# Altium schematic sheet ON_OFF_POWER_LED_v2_schematic.SchDoc
size A
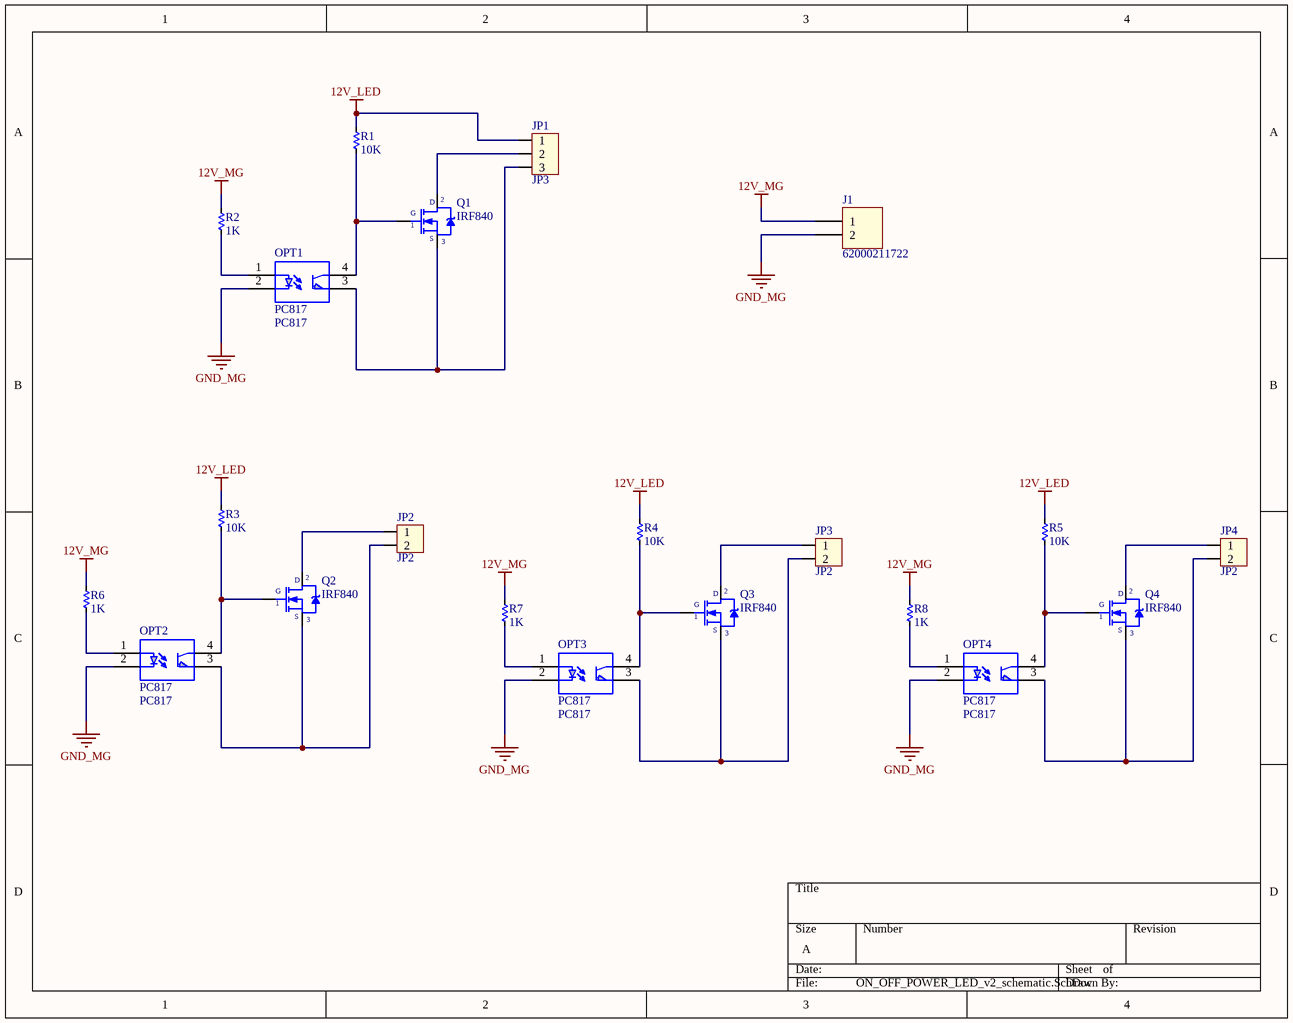
[diagram p0: ON_OFF_POWER_LED_v2_schematic.SchDoc]

## Parts
J1  62000211722  [62000211722]
JP1  JP3  [CON 3/7.62mm]
JP2  JP2  [CON 2/7.62mm]
JP3  JP2  [CON 2/7.62mm]
JP4  JP2  [CON 2/7.62mm]
OPT1  PC817  [DIP-4 SMD]
OPT2  PC817  [DIP-4 SMD]
OPT3  PC817  [DIP-4 SMD]
OPT4  PC817  [DIP-4 SMD]
Q1  IRF840  [TO220H1]
Q2  IRF840  [TO220H1]
Q3  IRF840  [TO220H1]
Q4  IRF840  [TO220H1]
R1  10K  [RES-SMD-0805]
R2  1K  [RES-SMD-0805]
R3  10K  [RES-SMD-0805]
R4  10K  [RES-SMD-0805]
R5  10K  [RES-SMD-0805]
R6  1K  [RES-SMD-0805]
R7  1K  [RES-SMD-0805]
R8  1K  [RES-SMD-0805]

## Nets
12V_LED: JP1.1 R1.1 R3.1 R4.1 R5.1
12V_MG: J1.1 R2.1 R6.1 R7.1 R8.1
GND_MG: J1.2 OPT1.2(K) OPT2.2(K) OPT3.2(K) OPT4.2(K)
NetJP1_2: JP1.2 Q1.2(D)
NetJP1_3: JP1.3 OPT1.3(EMISSOR) Q1.3(S)
NetJP2_1: JP2.1 Q2.2(D)
NetJP2_2: JP2.2 OPT2.3(EMISSOR) Q2.3(S)
NetJP3_1: JP3.1 Q3.2(D)
NetJP3_2: JP3.2 OPT3.3(EMISSOR) Q3.3(S)
NetJP4_1: JP4.1 Q4.2(D)
NetJP4_2: JP4.2 OPT4.3(EMISSOR) Q4.3(S)
NetOPT1_1: OPT1.1(A) R2.2
NetOPT1_4: OPT1.4(COLETOR) Q1.1(G) R1.2
NetOPT2_1: OPT2.1(A) R6.2
NetOPT2_4: OPT2.4(COLETOR) Q2.1(G) R3.2
NetOPT3_1: OPT3.1(A) R7.2
NetOPT3_4: OPT3.4(COLETOR) Q3.1(G) R4.2
NetOPT4_1: OPT4.1(A) R8.2
NetOPT4_4: OPT4.4(COLETOR) Q4.1(G) R5.2

## Library data of the parts
J1 = 62000211722: WR-WTB 2.00mm Male Horizontal Shrouded Header, 2p; Pin Number: 2; ComponentLink1Description: Manufacturer; ComponentLink1URL: http://www.we-online.de; ComponentLink2Description: Datasheet; ComponentLink2URL: http://katalog.we-online.de/em/datasheet/6200xx11722.pdf; Part Number: 62000211722; Published Date: June 2017; Publisher: Wurth Elektronik; Pitch: 2.00 mm
JP1 = Con3: Connector 3; Value: Connector 3
JP2-JP4 = Con2: Connector 2; Value: Connector 2
OPT1-OPT4 = PC817: OptoAcoplador 4 terminais; Encapsulamento: SMD; Descrição: OptoAcoplador 4 Terminais; Valor: *; Marca: *; Observação: *; Modelo: PC817
Q1-Q4 = IRF840: MOSFET N - CHANNEL 500V - 0.75 - 8A - TO-220; Value: IRF840
R1-R8 = Res-SMD: Resistor; Manufacturer: Generic Components; Class: Passive; Published: 08/06/2000; Publisher: Altium Hobart Technology Centre